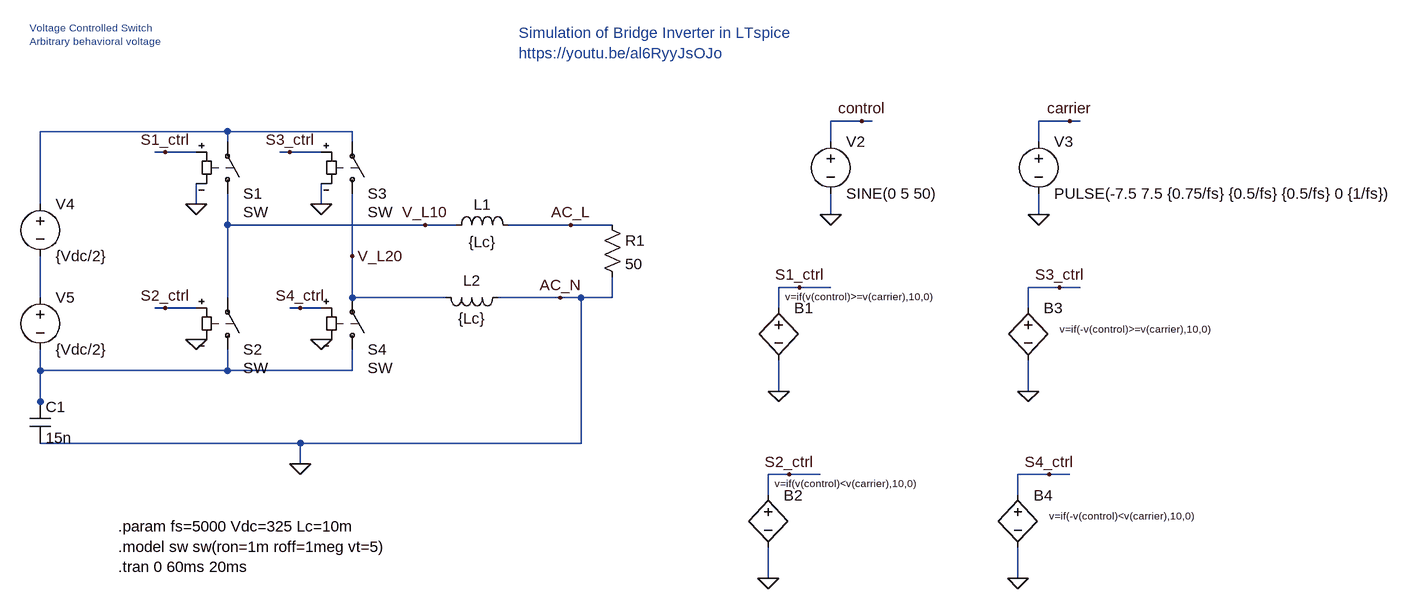
[diagram p0: schematic DC-to-AC-unipolar-full-bridge-solar.asc]
DC-to-AC-unipolar-full-bridge-solar.asc, the LTspice schematic file:
Version 4
SHEET 1 2072 724
WIRE 1152 0 1104 0
WIRE 1168 0 1152 0
WIRE 1472 0 1424 0
WIRE 1488 0 1472 0
WIRE 176 16 -112 16
WIRE 368 16 176 16
WIRE 176 32 176 16
WIRE 368 32 368 16
WIRE 1104 32 1104 0
WIRE 1424 32 1424 0
WIRE 80 48 64 48
WIRE 128 48 80 48
WIRE 272 48 256 48
WIRE 320 48 272 48
WIRE -112 128 -112 16
WIRE 128 128 128 96
WIRE 320 128 320 96
WIRE 1104 144 1104 112
WIRE 1424 144 1424 112
WIRE 176 160 176 112
WIRE 480 160 176 160
WIRE 528 160 480 160
WIRE 704 160 608 160
WIRE 768 160 704 160
WIRE 368 208 368 112
WIRE 1056 256 1024 256
WIRE 1104 256 1056 256
WIRE 1456 256 1408 256
WIRE 1488 256 1456 256
WIRE -112 272 -112 208
WIRE 176 272 176 160
WIRE 368 272 368 208
WIRE 512 272 368 272
WIRE 688 272 592 272
WIRE 720 272 688 272
WIRE 768 272 768 240
WIRE 768 272 720 272
WIRE 80 288 64 288
WIRE 128 288 80 288
WIRE 288 288 272 288
WIRE 320 288 288 288
WIRE 1024 288 1024 256
WIRE 1408 288 1408 256
WIRE -112 384 -112 352
WIRE 176 384 176 352
WIRE 176 384 -112 384
WIRE 368 384 368 352
WIRE 368 384 176 384
WIRE 1024 416 1024 368
WIRE 1408 416 1408 368
WIRE -112 432 -112 384
WIRE -112 448 -112 432
WIRE 288 496 -112 496
WIRE 720 496 720 272
WIRE 720 496 288 496
WIRE 288 528 288 496
WIRE 1040 544 1008 544
WIRE 1088 544 1040 544
WIRE 1440 544 1392 544
WIRE 1472 544 1440 544
WIRE 1008 576 1008 544
WIRE 1392 576 1392 544
WIRE 1008 704 1008 656
WIRE 1392 704 1392 656
FLAG 320 128 0
FLAG 128 128 0
FLAG 128 336 0
FLAG 320 336 0
FLAG 80 48 S1_ctrl
FLAG 288 288 S4_ctrl
FLAG 272 48 S3_ctrl
FLAG 80 288 S2_ctrl
FLAG 1104 144 0
FLAG 1424 144 0
FLAG 1152 0 control
FLAG 1472 0 carrier
FLAG 1024 416 0
FLAG 1408 416 0
FLAG 1056 256 S1_ctrl
FLAG 1456 256 S3_ctrl
FLAG 1008 704 0
FLAG 1392 704 0
FLAG 1040 544 S2_ctrl
FLAG 1440 544 S4_ctrl
FLAG 480 160 V_L10
FLAG 368 208 V_L20
FLAG 704 160 AC_L
FLAG 688 272 AC_N
FLAG 288 528 0
SYMBOL sw 176 128 M180
WINDOW 3 24 -12 Left 2
SYMATTR InstName S1
SYMBOL sw 176 368 M180
WINDOW 3 24 -12 Left 2
SYMATTR InstName S2
SYMBOL sw 368 128 M180
WINDOW 3 24 -12 Left 2
SYMATTR InstName S3
SYMBOL sw 368 368 M180
WINDOW 3 24 -12 Left 2
SYMATTR InstName S4
SYMBOL ind 512 176 R270
WINDOW 0 32 56 VTop 2
WINDOW 3 5 56 VBottom 2
SYMATTR InstName L1
SYMATTR Value {Lc}
SYMATTR SpiceLine Rser=200m
SYMBOL cap -128 432 R0
SYMATTR InstName C1
SYMATTR Value 15n
SYMATTR SpiceLine Rser=100m
SYMBOL res 752 144 R0
SYMATTR InstName R1
SYMATTR Value 50
SYMBOL voltage 1104 16 R0
WINDOW 123 0 0 Left 0
WINDOW 39 0 0 Left 0
SYMATTR InstName V2
SYMATTR Value SINE(0 5 50)
SYMBOL voltage 1424 16 R0
WINDOW 123 0 0 Left 0
WINDOW 39 0 0 Left 0
SYMATTR InstName V3
SYMATTR Value PULSE(-7.5 7.5 {0.75/fs} {0.5/fs} {0.5/fs} 0 {1/fs})
SYMBOL bv 1024 272 R0
WINDOW 3 10 -2 Left 1
SYMATTR Value v=if(v(control)>=v(carrier),10,0)
SYMATTR InstName B1
SYMBOL bv 1408 272 R0
WINDOW 3 48 48 Left 1
SYMATTR Value v=if(-v(control)>=v(carrier),10,0)
SYMATTR InstName B3
SYMBOL bv 1008 560 R0
WINDOW 3 10 -2 Left 1
SYMATTR Value v=if(v(control)<v(carrier),10,0)
SYMATTR InstName B2
SYMBOL bv 1392 560 R0
WINDOW 3 48 48 Left 1
SYMATTR Value v=if(-v(control)<v(carrier),10,0)
SYMATTR InstName B4
SYMBOL voltage -112 112 R0
SYMATTR InstName V4
SYMATTR Value {Vdc/2}
SYMBOL voltage -112 256 R0
SYMATTR InstName V5
SYMATTR Value {Vdc/2}
SYMBOL ind 608 256 R90
WINDOW 0 5 56 VBottom 2
WINDOW 3 32 56 VTop 2
SYMATTR InstName L2
SYMATTR Value {Lc}
TEXT 8 624 Left 2 !.param fs=5000 Vdc=325 Lc=10m\n.model sw sw(ron=1m roff=1meg vt=5)\n.tran 0 60ms 20ms
TEXT 624 -136 Left 2 ;Simulation of Bridge Inverter in LTspice\nhttps://youtu.be/al6RyyJsOJo
TEXT -128 -144 Left 1 ;Voltage Controlled Switch\nArbitrary behavioral voltage

The netlist it stands for:
* DC-to-AC-unipolar-full-bridge-solar.asc
S1 V_L10 N001 S1_ctrl 0 SW
S2 N003 V_L10 S2_ctrl 0 SW
S3 V_L20 N001 S3_ctrl 0 SW
S4 N003 V_L20 S4_ctrl 0 SW
L1 V_L10 AC_L {Lc} Rser=200m
C1 N003 0 15n Rser=100m
R1 AC_L 0 50
V2 control 0 SINE(0 5 50)
V3 carrier 0 PULSE(-7.5 7.5 {0.75/fs} {0.5/fs} {0.5/fs} 0 {1/fs})
B1 S1_ctrl 0 v=if(v(control)>=v(carrier),10,0)
B3 S3_ctrl 0 v=if(-v(control)>=v(carrier),10,0)
B2 S2_ctrl 0 v=if(v(control)<v(carrier),10,0)
B4 S4_ctrl 0 v=if(-v(control)<v(carrier),10,0)
V4 N001 N002 {Vdc/2}
V5 N002 N003 {Vdc/2}
L2 0 V_L20 {Lc}
.param fs=5000 Vdc=325 Lc=10m
.model sw sw(ron=1m roff=1meg vt=5)
.tran 0 60ms 20ms
* Simulation of Bridge Inverter in LTspice
* https://youtu.be/al6RyyJsOJo
* Voltage Controlled Switch
* Arbitrary behavioral voltage
.backanno
.end